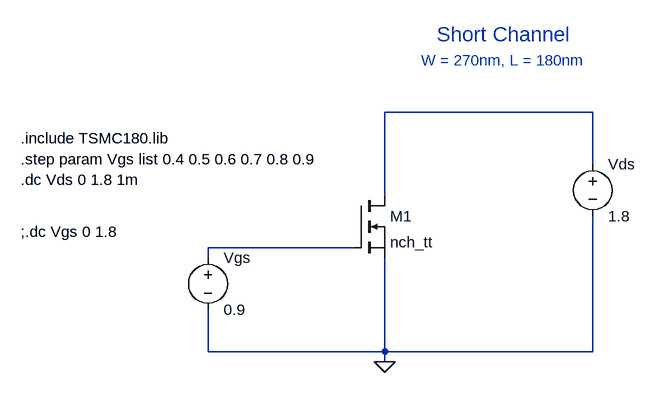
[diagram p0: schematic Q4_nmos_sc.asc]
Q4_nmos_sc.asc, the LTspice schematic file:
Version 4
SHEET 1 880 680
WIRE 592 -160 272 -160
WIRE 592 -80 592 -160
WIRE 272 -32 272 -160
WIRE 224 48 0 48
WIRE 0 64 0 48
WIRE 0 208 0 144
WIRE 272 208 272 64
WIRE 272 208 0 208
WIRE 592 208 592 0
WIRE 592 208 272 208
WIRE 272 224 272 208
FLAG 272 224 0
SYMBOL voltage 0 48 R0
WINDOW 123 0 0 Left 0
WINDOW 39 0 0 Left 0
SYMATTR InstName Vgs
SYMATTR Value 0.9
SYMBOL nmos 224 -32 R0
SYMATTR InstName M1
SYMATTR Value nch_tt
SYMATTR Value2 l=180n w=270n
SYMBOL voltage 592 -96 R0
WINDOW 123 0 0 Left 0
WINDOW 39 0 0 Left 0
SYMATTR InstName Vds
SYMATTR Value 1.8
TEXT -288 -120 Left 2 !.include TSMC180.lib
TEXT -288 -88 Left 2 !.step param Vgs list 0.4 0.5 0.6 0.7 0.8 0.9
TEXT -288 -56 Left 2 !.dc Vds 0 1.8 1m
TEXT -288 24 Left 2 !;.dc Vgs 0 1.8
TEXT 352 -280 Left 3 ;Short Channel
TEXT 328 -240 Left 2 ;W = 270nm, L = 180nm

The netlist it stands for:
* Q4_nmos_sc.asc
Vgs N002 0 0.9
M1 N001 N002 0 0 nch_tt l=180n w=270n
Vds N001 0 1.8
.model NMOS NMOS
.model PMOS PMOS
.lib standard.mos
.include TSMC180.lib
.step param Vgs list 0.4 0.5 0.6 0.7 0.8 0.9
.dc Vds 0 1.8 1m
;.dc Vgs 0 1.8
* Short Channel
* W = 270nm, L = 180nm
.backanno
.end